# Altium schematic sheet Sheet2.SchDoc
size A; SheetNumber: 7; SheetTotal: 7
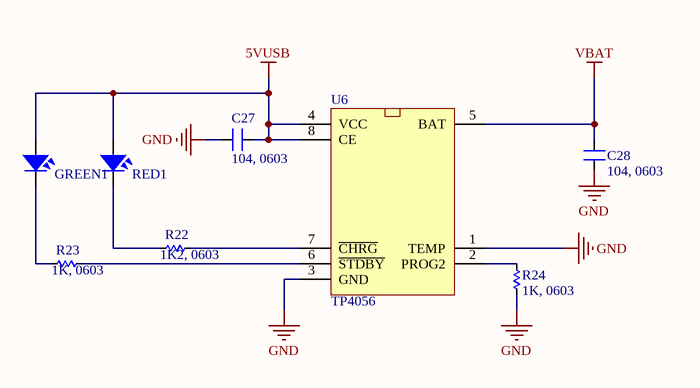
[diagram p0: Sheet2.SchDoc]

## Parts
C27  104, 0603  [SM-0603]
C28  104, 0603  [SM-0603]
GREEN1  LED  [LED-0805-Blue]  (value not drawn)
R22  1K2, 0603  [RES-SMD-0603]
R23  1K, 0603  [RES-SMD-0603]
R24  1K, 0603  [RES-SMD-0603]
RED1  LED  [LED-0805-Blue]  (value not drawn)
U6  TP4056  [SOP8_L]

## Nets
5VUSB: C27.1 GREEN1.1 RED1.1 U6.4(VCC) U6.8(CE)
GND: C27.2 C28.2 R24.2 U6.1(TEMP) U6.3(GND)
VBAT: C28.1 U6.5(BAT)
NetGREEN1_2: GREEN1.2 R23.2
NetR22_1: R22.1 U6.7(~{CHRG})
NetR22_2: R22.2 RED1.2
NetR23_1: R23.1 U6.6(~{STDBY})
NetR24_1: R24.1 U6.2(PROG2)

## Library data of the parts
C27 C28 = CM: Cap SMD; Value: 103
GREEN1 RED1 = LED SMD: Value: LED 3 - 5 ly 2 Colour
R22-R24 = Res-SMD: Resistor; Manufacturer: Generic Components; Class: Passive; Published: 08/06/2000; Publisher: Altium Hobart Technology Centre
U6 = TP4056: 1A Standalone Linear Li-lon Battery Charger with Thermal   Regulation